# Altium project RC Transmitter PCB.PrjPcb
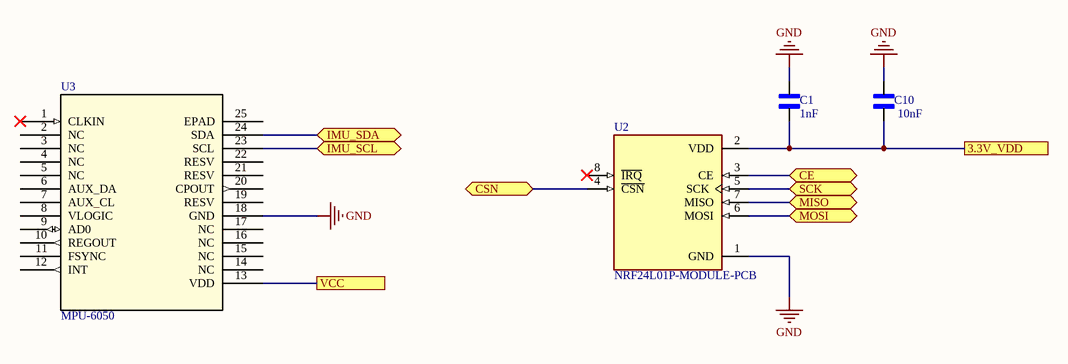
[diagram p0: RC Transmitter Backend.SchDoc]
2 sheets, 25 parts. Net scope: flat (ports and power ports of the same name join across sheets).
Board file: RC Transmitter PCBDoc.PcbDoc
Sheets:
  RC Transmitter Backend.SchDoc
  RC Transmitter Frontend.SchDoc

## Sheet RC Transmitter Backend.SchDoc
size A; SheetNumber: 1; SheetTotal: 3

### Parts
C1  1nF  [CAPC1005X55N]
C10  10nF  [CAPC0603X33N]
U2  NRF24L01P-MODULE-PCB  [XCVR_NRF24L01P-MODULE-PCB]
U3  MPU-6050  [QFN24_4X4X0P9-0P5_TDK-L]

### Ports
3.3V_VDD (see RC Transmitter Frontend[2A]), CE (bidir, see RC Transmitter Frontend[3C]), CSN (bidir, see RC Transmitter Frontend[3C]), IMU_SCL (bidir, see RC Transmitter Frontend[2B]), IMU_SDA (bidir, see RC Transmitter Frontend[2B]), MISO (bidir, see RC Transmitter Frontend[2C]), MOSI (bidir, see RC Transmitter Frontend[2C]), SCK (bidir, see RC Transmitter Frontend[2C]), VCC (see RC Transmitter Frontend[1B], RC Transmitter Frontend[1C], RC Transmitter Frontend[2D], RC Transmitter Frontend[3A], RC Transmitter Frontend[3B], RC Transmitter Frontend[4A])

### Nets
GND: C1.2 C10.2 U2.1(GND) U3.18(GND)
VCC: U3.13(VDD) ; port VCC
NetC1_1: C1.1 C10.1 U2.2(VDD) ; port 3.3V_VDD
NetU1_JP2_1: U3.24(SDA) ; port IMU_SDA
NetU1_JP2_2: U3.23(SCL) ; port IMU_SCL
NetU1_JP6_9: U2.5(SCK) ; port SCK
NetU1_JP6_10: U2.7(MISO) ; port MISO
NetU1_JP6_11: U2.6(MOSI) ; port MOSI
NetU1_JP7_4: U2.4(~{CSN}) ; port CSN
NetU1_JP7_5: U2.3(CE) ; port CE

Not connected (* = marked no-connect by the designer): U2 8(~{IRQ})*; U3 1(CLKIN)* 2(NC) 3(NC) 4(NC) 5(NC) 6(AUX_DA) 7(AUX_CL) 8(VLOGIC) 9(AD0) 10(REGOUT) 11(FSYNC) 12(INT) 14(NC) 15(NC) 16(NC) 17(NC) 19(RESV) 20(CPOUT) 21(RESV) 22(RESV) 25(EPAD)

### Library data of the parts
C1 = GRM155R61A102KA01D: SMD-ÐºÐ¾Ð½Ð´ÐµÐ½ÑÐ°Ñ‚Ð¾Ñ€ X5R(EIA) Ñ Ñ‘Ð¼ÐºÐ¾ÑÑ‚ÑŒÑŽ 1000 Ð¿Ð¤, Ð´Ð¾Ð¿ÑƒÑÐº 10 %. ÐÐ¾Ð¼Ð¸Ð½Ð°Ð»ÑŒÐ½Ð¾Ðµ Ð½Ð°Ð¿Ñ€ÑÐ¶ÐµÐ½Ð¸Ðµ: 10 Ð’ Ð¿Ð¾ÑÑ‚Ð¾ÑÐ½Ð½Ð¾Ð³Ð¾ Ñ‚Ð¾ÐºÐ°; MF: Murata Electronics; SnapEDA_Link: https://www.snapeda.com/parts/GRM155R61A102KA01D/Murata+Electronics+North+America/view-part/?ref=snap; Package: 1005-2 Murata; Value: *; MP: GRM155R61A102KA01D; Check_prices: https://www.snapeda.com/parts/GRM155R61A102KA01D/Murata+Electronics+North+America/view-part/?ref=eda
C10 = GRM033R71A103KA01D: 10000 pF Â±10% 10V Ceramic Capacitor X7R 0201 (0603 Metric); MF: Murata; SnapEDA_Link: https://www.snapeda.com/parts/GRM033R71A103KA01D/Murata/view-part/?ref=snap; Package: 0603 Murata; Value: *; MP: GRM033R71A103KA01D; Check_prices: https://www.snapeda.com/parts/GRM033R71A103KA01D/Murata/view-part/?ref=eda; ComponentLink1Description: New link; ComponentLink1URL: *
U2 = NRF24L01P-MODULE-PCB: - Transceiver For Use With nRF24L01+; MF: Nordic Semiconductor; Package: None; MP: NRF24L01P-MODULE-PCB; Value: *; Availability: Bad; Price: None; SnapEDA_Link: https://www.snapeda.com/parts/NRF24L01P-MODULE-PCB/Nordic%20Semiconductor%20ASA/view-part/230534/?ref=snap; Mouser-Purchase-URL: https://snapeda.com/shop?store=Mouser&id=230534
U3 = MPU-6050: Description; Manufacturer_Name: TDK; Type: Motion Sensors; Copyright: Copyright (C) 2025 Ultra Librarian. All rights reserved.; Manufacturer_Part_Number: MPU-6050; RefDes: RefDes

## Sheet RC Transmitter Frontend.SchDoc
size A; SheetNumber: 2; SheetTotal: 2
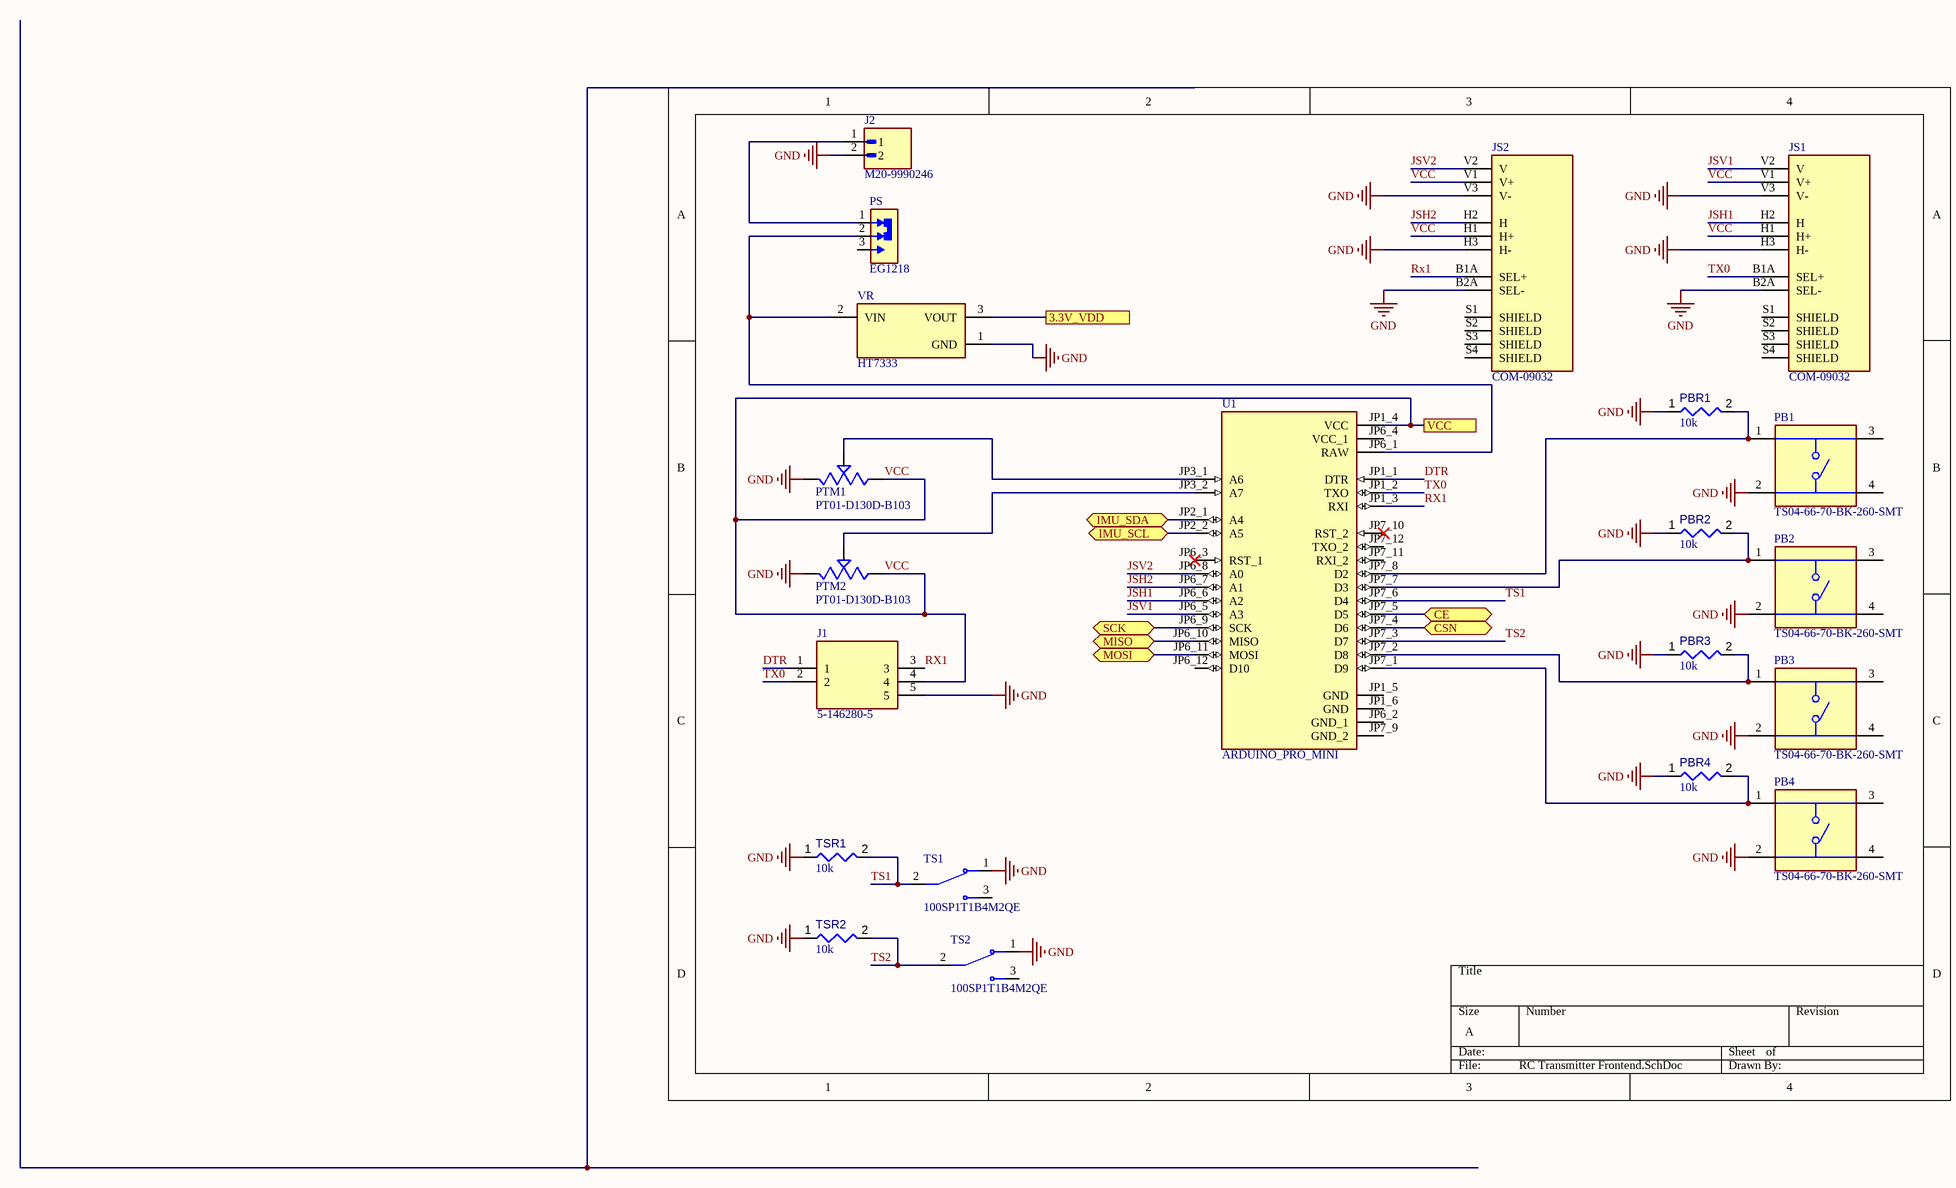
[diagram p1: RC Transmitter Frontend.SchDoc]

### Parts
J1  5-146280-5  [TE_5-146280-5]
J2  M20-9990246  [HARWIN_M20-9990246]
JS1  COM-09032  [XDCR_COM-09032]
JS2  COM-09032  [XDCR_COM-09032]
PB1  TS04-66-70-BK-260-SMT  [SW_TS04-66-70-BK-260-SMT]
PB2  TS04-66-70-BK-260-SMT  [SW_TS04-66-70-BK-260-SMT]
PB3  TS04-66-70-BK-260-SMT  [SW_TS04-66-70-BK-260-SMT]
PB4  TS04-66-70-BK-260-SMT  [SW_TS04-66-70-BK-260-SMT]
PBR1  value 10k  [RESC0402(1005)_L]  (hidden comment: 10KR2F)
PBR2  value 10k  [RESC0402(1005)_L]  (hidden comment: 10KR2F)
PBR3  value 10k  [RESC0402(1005)_L]  (hidden comment: 10KR2F)
PBR4  value 10k  [RESC0402(1005)_L]  (hidden comment: 10KR2F)
PS  EG1218  [SW_EG1218]
PTM1  PT01-D130D-B103  [TRIM_PT01-D130D-B103]
PTM2  PT01-D130D-B103  [TRIM_PT01-D130D-B103]
TS1  100SP1T1B4M2QE  [SW_100SP1T1B4M2QE]
TS2  100SP1T1B4M2QE  [SW_100SP1T1B4M2QE]
TSR1  value 10k  [RESC0402(1005)_L]  (hidden comment: 10KR2F)
TSR2  value 10k  [RESC0402(1005)_L]  (hidden comment: 10KR2F)
U1  ARDUINO_PRO_MINI  [MODULE_ARDUINO_PRO_MINI]
VR  HT7333  [IC_HT7333]

### Ports
3.3V_VDD (see RC Transmitter Backend[4B]), CE (bidir, see RC Transmitter Backend[3B]), CSN (bidir, see RC Transmitter Backend[2B]), IMU_SCL (bidir, see RC Transmitter Backend[2B]), IMU_SDA (bidir, see RC Transmitter Backend[2B]), MISO (bidir, see RC Transmitter Backend[3B]), MOSI (bidir, see RC Transmitter Backend[3C]), SCK (bidir, see RC Transmitter Backend[3B]), VCC (see RC Transmitter Backend[2C])

### Nets
GND: J1.5 J2.2 JS1.B2A(SEL-) JS1.H3(H-) JS1.V3(V-) JS2.B2A(SEL-) JS2.H3(H-) JS2.V3(V-) PB1.2 PB2.2 PB3.2 PB4.2 PBR1.1 PBR2.1 PBR3.1 PBR4.1 PTM1.1 PTM2.1 TS1.1 TS2.1 TSR1.1 TSR2.1 VR.1(GND)
DTR: J1.1 U1.JP1_1(DTR)
JSH1: JS1.H2(H) U1.JP6_6(A2)
JSH2: JS2.H2(H) U1.JP6_7(A1)
JSV1: JS1.V2(V) U1.JP6_5(A3)
JSV2: JS2.V2(V) U1.JP6_8(A0)
RX1: J1.3 JS2.B1A(SEL+) U1.JP1_3(RXI)
TS1: TS1.2 TSR1.2 U1.JP7_6(D4)
TS2: TS2.2 TSR2.2 U1.JP7_3(D7)
TX0: J1.2 JS1.B1A(SEL+) U1.JP1_2(TXO)
VCC: J1.4 JS1.H1(H+) JS1.V1(V+) JS2.H1(H+) JS2.V1(V+) PTM1.3 PTM2.3 U1.JP1_4(VCC) ; port VCC
NetC1_1: VR.3(VOUT) ; port 3.3V_VDD
NetJ2_1: J2.1 PS.1(NC)
NetPB1_1: PB1.1 PBR1.2 U1.JP7_8(D2)
NetPB2_1: PB2.1 PBR2.2 U1.JP7_7(D3)
NetPB3_1: PB3.1 PBR3.2 U1.JP7_2(D8)
NetPB4_1: PB4.1 PBR4.2 U1.JP7_1(D9)
NetPS_2: PS.2(COM) U1.JP6_1(RAW) VR.2(VIN)
NetPTM1_2: PTM1.2 U1.JP3_1(A6)
NetPTM2_2: PTM2.2 U1.JP3_2(A7)
NetU1_JP2_1: U1.JP2_1(A4) ; port IMU_SDA
NetU1_JP2_2: U1.JP2_2(A5) ; port IMU_SCL
NetU1_JP6_9: U1.JP6_9(SCK) ; port SCK
NetU1_JP6_10: U1.JP6_10(MISO) ; port MISO
NetU1_JP6_11: U1.JP6_11(MOSI) ; port MOSI
NetU1_JP7_4: U1.JP7_4(D6) ; port CSN
NetU1_JP7_5: U1.JP7_5(D5) ; port CE

Not connected (* = marked no-connect by the designer): JS1 S1(SHIELD) S2(SHIELD) S3(SHIELD) S4(SHIELD); JS2 S1(SHIELD) S2(SHIELD) S3(SHIELD) S4(SHIELD); PB1 3 4; PB2 3 4; PB3 3 4; PB4 3 4; PS 3(NO); TS1 3; TS2 3; U1 JP1_5(GND) JP1_6(GND) JP6_2(GND_1) JP6_3(RST_1)* JP6_4(VCC_1) JP6_12(D10) JP7_9(GND_2) JP7_10(RST_2)* JP7_11(RXI_2) JP7_12(TXO_2)

### Library data of the parts
J1 = 5-146280-5: 05 MODII HDR SRST B/A .100CL; Package: None; Value: *; Price: None; MP: 5-146280-5; Availability: Unavailable
J2 = M20-9990246: 2.54mm (0.1) Pitch SIL Vertical Throughboard Pin Header, 6.1mm mating pin height, tin, 2 contacts; MF: Harwin; SnapEDA_Link: https://www.snapeda.com/parts/M20-9990246/Harwin/view-part/?ref=snap; Package: None; Value: *; MP: M20-9990246; Check_prices: https://www.snapeda.com/parts/M20-9990246/Harwin/view-part/?ref=eda
JS1 JS2 = COM-09032: Thumb Joystick; Price: None; Availability: Unavailable; MP: COM-09032; Value: *; Package: None
PB1-PB4 = TS04-66-70-BK-260-SMT: 6 x 6 mm, 7 mm Actuator Height, 260 gf, Black, Surface Mount, SPST, Tactile Switch; MF: Same Sky; SnapEDA_Link: https://www.snapeda.com/parts/TS04-66-70-BK-260-SMT/Same+Sky/view-part/?ref=snap; Package: None; Value: *; MP: TS04-66-70-BK-260-SMT; Check_prices: https://www.snapeda.com/parts/TS04-66-70-BK-260-SMT/Same+Sky/view-part/?ref=eda
PBR1-PBR4 TSR1 TSR2 = CMP-009-00066-2: 10K 0.063W 1% 0402 (1005 Metric)  SMD; Power: 63mW; Case/Package: 0402; Mounting Technology: SMT; Pins: 2; Tolerance: 1%
PS = EG1218: Slide Switch, EG Series, SPDT, Non-Shorting, ON-ON, 200mA DC, 30VDC, PC Pin | E-Switch EG1218; SnapEDA_Link: https://www.snapeda.com/parts/EG1218/E-Switch/view-part/?ref=snap; Package: None; Value: *; MF: E-Switch; MP: EG1218; Check_prices: https://www.snapeda.com/parts/EG1218/E-Switch/view-part/?ref=eda
PTM1 PTM2 = PT01-D130D-B103: 10 mm, Vertical, Linear, 10 kÎ©, Through Hole, D-cut Rotary Potentiometer; MF: Same Sky; SnapEDA_Link: https://www.snapeda.com/parts/PT01-D130D-B103/Same+Sky/view-part/?ref=snap; Package: None; Value: *; MP: PT01-D130D-B103; Check_prices: https://www.snapeda.com/parts/PT01-D130D-B103/Same+Sky/view-part/?ref=eda
TS1 TS2 = 100SP1T1B4M2QE: Toggle Switch SPDT Through Hole; Package: None; Price: None; Value: *; MP: 100SP1T1B4M2QE; Availability: Unavailable
U1 = ARDUINO_PRO_MINI: This board was developed for applications and installations where space is premium and projects are made as permanent set ups. Small, available in 3.3 V and 5 V versions, powered by ATmega328P.; MP: Arduino Pro Mini; SnapEDA_Link: https://www.snapeda.com/parts/Arduino%20Pro%20Mini/Arduino/view-part/?ref=snap; Package: None; Value: *; MF: Arduino; Check_prices: https://www.snapeda.com/parts/Arduino%20Pro%20Mini/Arduino/view-part/?ref=eda
VR = HT7333: Three-terminal, low power, high voltage regulator implemented in CMOS technology; MF: Holtek Semiconductor; SnapEDA_Link: https://www.snapeda.com/parts/HT7333/Holtek/view-part/?ref=snap; Package: None; Value: *; MP: HT7333; Check_prices: https://www.snapeda.com/parts/HT7333/Holtek/view-part/?ref=eda

## Nets that join several sheets
GND: RC Transmitter Backend (C1.2 C10.2 U2.1 U3.18), RC Transmitter Frontend (23 pins)
NetC1_1: RC Transmitter Backend (C1.1 C10.1 U2.2), RC Transmitter Frontend (VR.3)
NetU1_JP2_1: RC Transmitter Backend (U3.24), RC Transmitter Frontend (U1.JP2_1)
NetU1_JP2_2: RC Transmitter Backend (U3.23), RC Transmitter Frontend (U1.JP2_2)
NetU1_JP6_9: RC Transmitter Backend (U2.5), RC Transmitter Frontend (U1.JP6_9)
NetU1_JP6_10: RC Transmitter Backend (U2.7), RC Transmitter Frontend (U1.JP6_10)
NetU1_JP6_11: RC Transmitter Backend (U2.6), RC Transmitter Frontend (U1.JP6_11)
NetU1_JP7_4: RC Transmitter Backend (U2.4), RC Transmitter Frontend (U1.JP7_4)
NetU1_JP7_5: RC Transmitter Backend (U2.3), RC Transmitter Frontend (U1.JP7_5)
VCC: RC Transmitter Backend (U3.13), RC Transmitter Frontend (8 pins)